# Altium schematic sheet [28] - PWR IN, MECH, DOC.SchDoc
size A2; DocumentNumber: 28; SheetNumber: 28; SheetTotal: 31
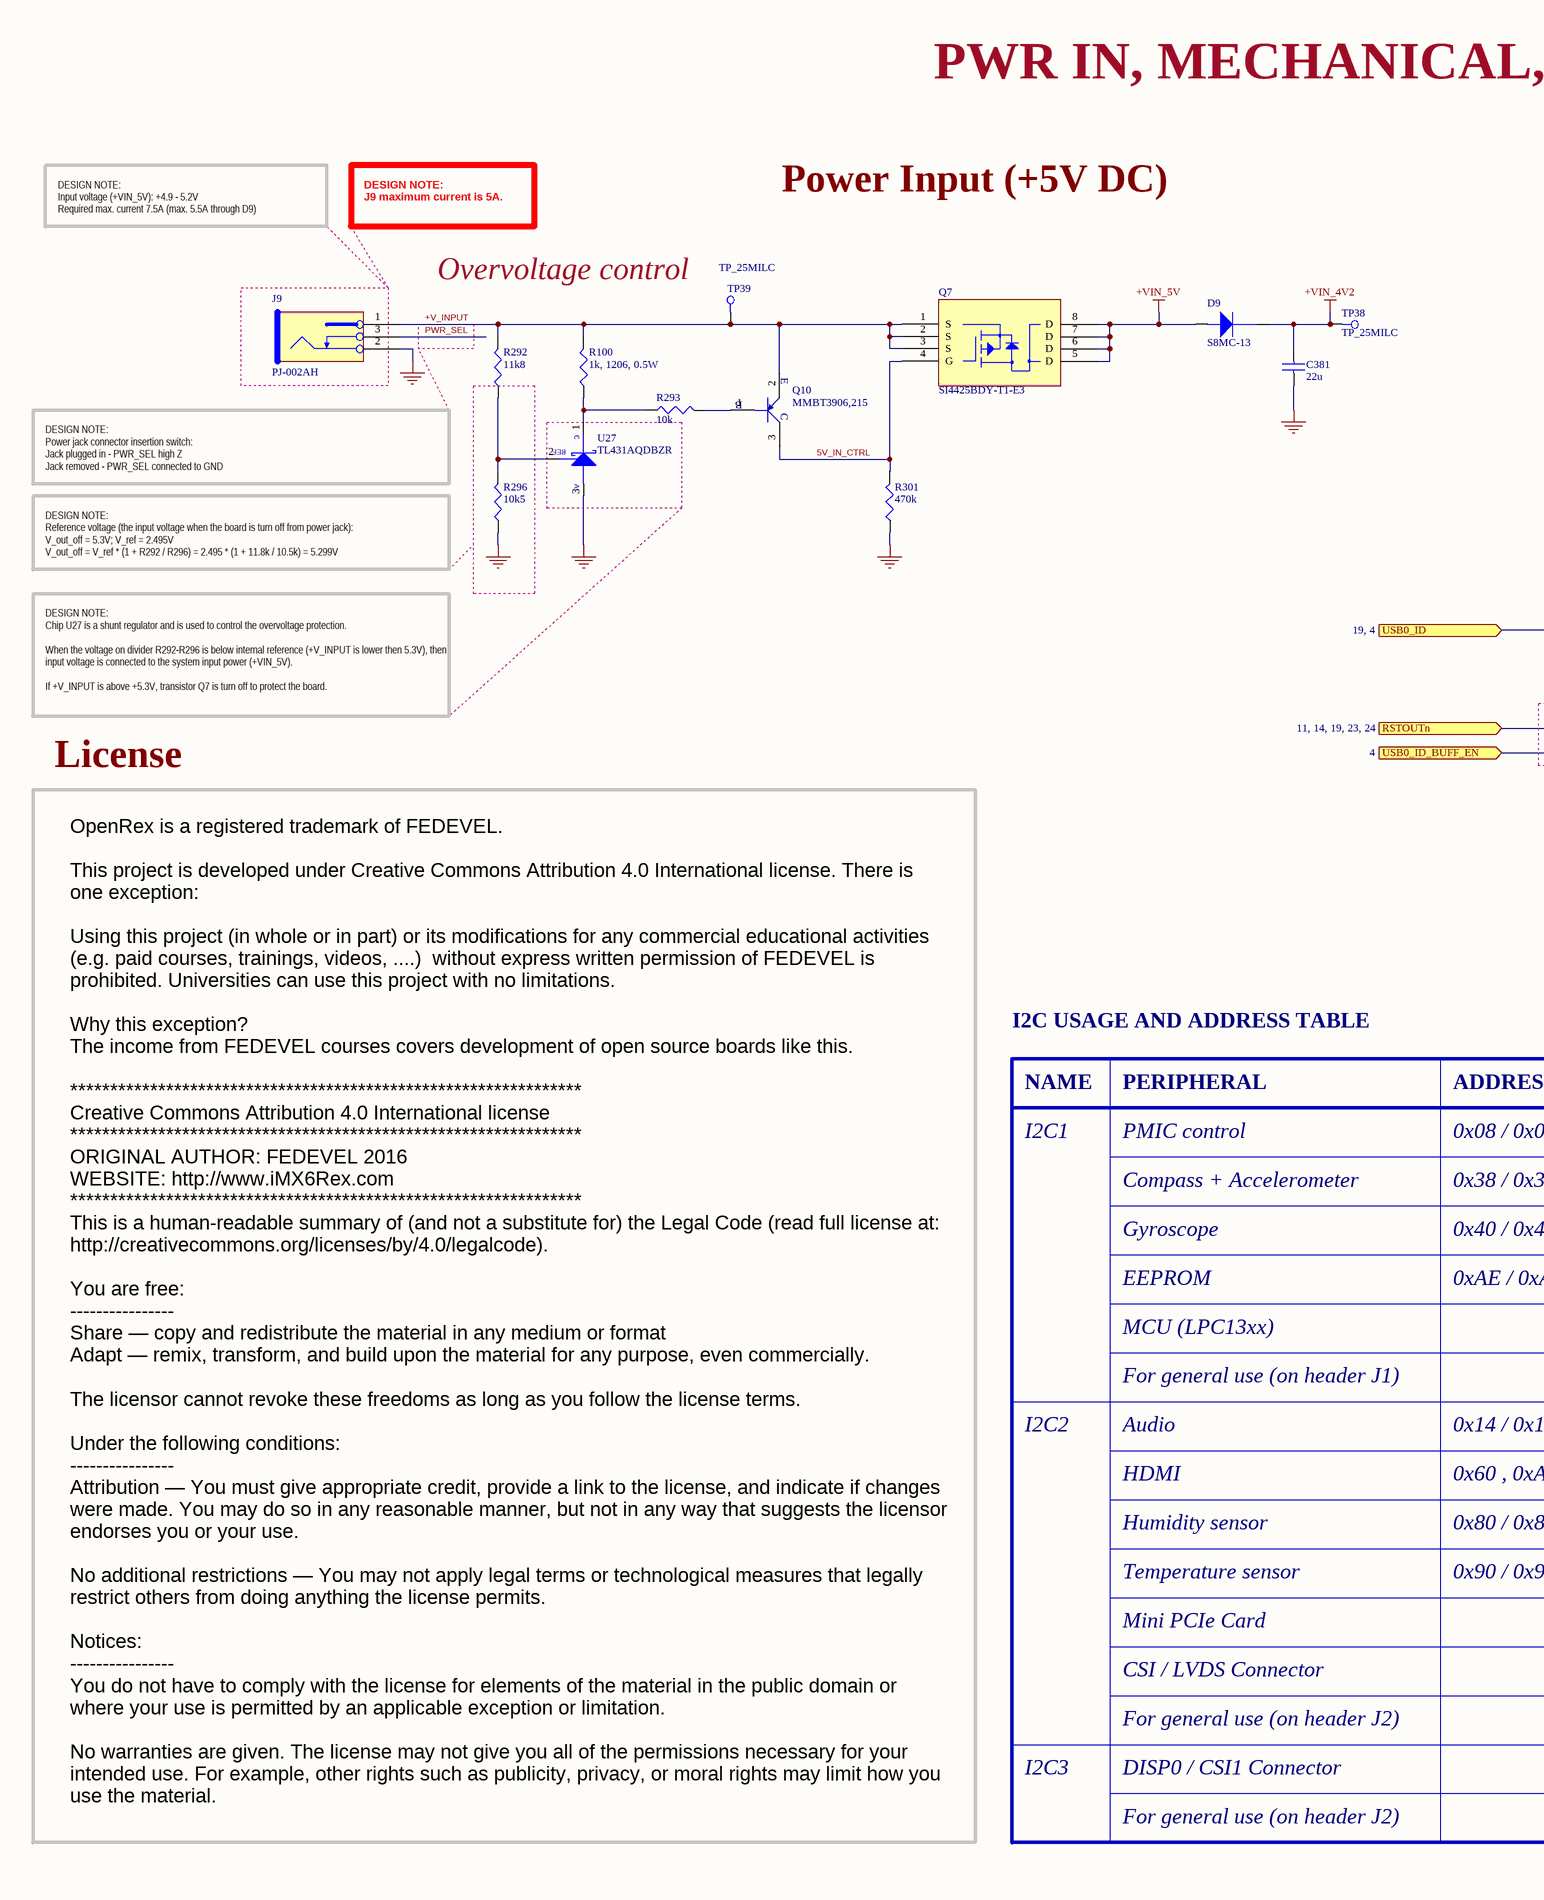
[diagram p0: [28] - PWR IN, MECH, DOC.SchDoc, left]
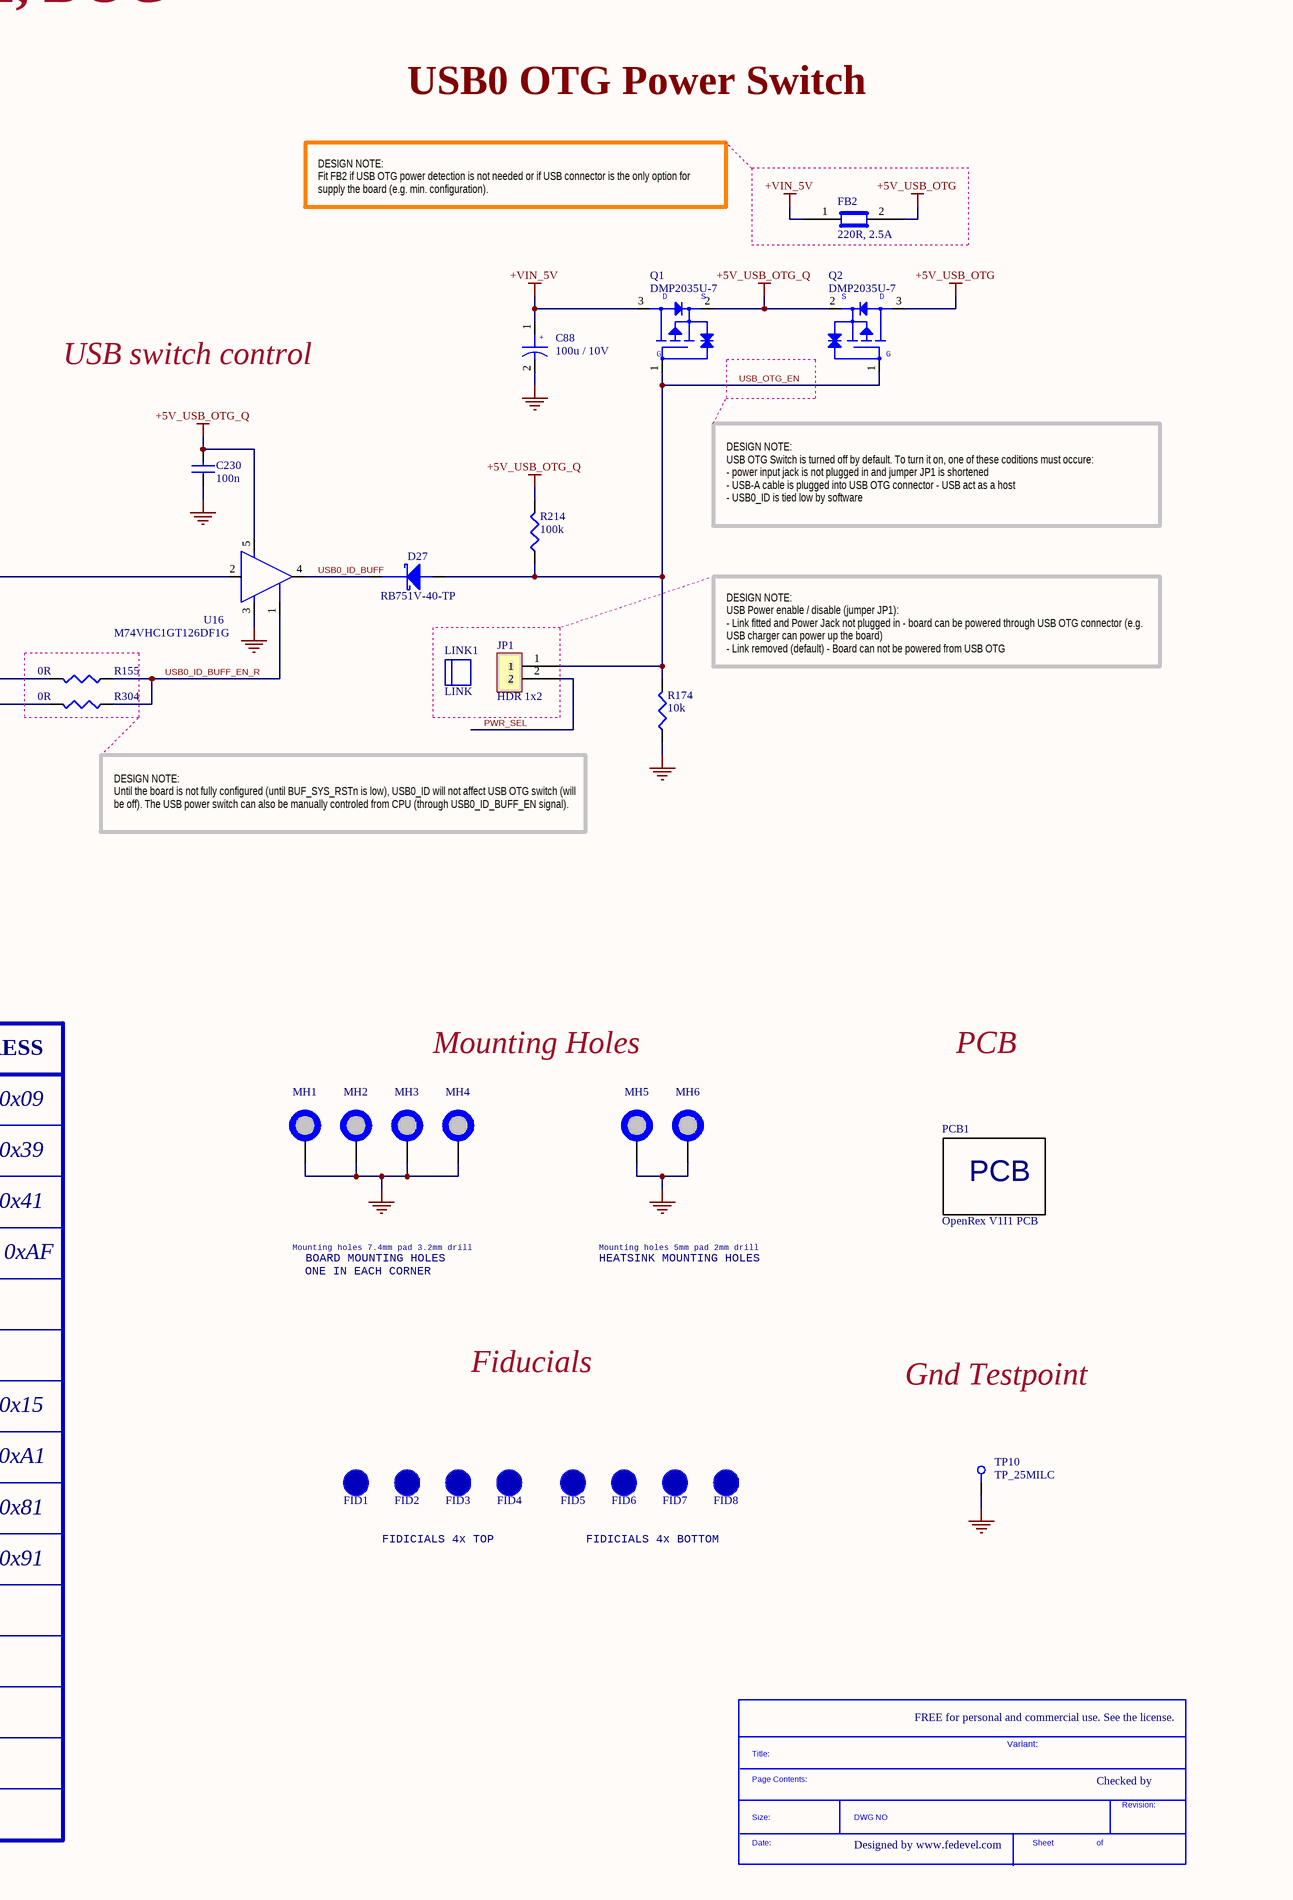
[diagram p1: [28] - PWR IN, MECH, DOC.SchDoc, right]

## Parts
*  SDTitleBlock  (value not drawn)  (graphical)
C88  100u / 10V  [C2312]
C230  100n  [C0402]
C381  22u  [C0603]
D9  S8MC-13  [SMC]
D27  RB751V-40-TP  [SOD323]
FB2  220R, 2.5A  [C0603]
FID1  FID_1MM_SMALL  [FID_40X52D]  (value not drawn)  (no BOM)
FID2  FID_1MM_SMALL  [FID_40X52D]  (value not drawn)  (no BOM)
FID3  FID_1MM_SMALL  [FID_40X52D]  (value not drawn)  (no BOM)
FID4  FID_1MM_SMALL  [FID_40X52D]  (value not drawn)  (no BOM)
FID5  FID_1MM_SMALL  [FID_40X52D]  (value not drawn)  (no BOM)
FID6  FID_1MM_SMALL  [FID_40X52D]  (value not drawn)  (no BOM)
FID7  FID_1MM_SMALL  [FID_40X52D]  (value not drawn)  (no BOM)
FID8  FID_1MM_SMALL  [FID_40X52D]  (value not drawn)  (no BOM)
J9  PJ-002AH  [POWER_JACK_5.5_2.1MM_NS_v1.1]
JP1  HDR 1x2  [HDR_1x2_2.54MM]
LINK1  LINK  (mechanical)
MH1  MH_7.4MMC_3.2MMD  [MH_7.4MMD_3.2MMD]  (value not drawn)  (no BOM)
MH2  MH_7.4MMC_3.2MMD  [MH_7.4MMD_3.2MMD]  (value not drawn)  (no BOM)
MH3  MH_7.4MMC_3.2MMD  [MH_7.4MMD_3.2MMD]  (value not drawn)  (no BOM)
MH4  MH_7.4MMC_3.2MMD  [MH_7.4MMD_3.2MMD]  (value not drawn)  (no BOM)
MH5  MH_5MMC_2MMD  [MH_5MMD_2MMD]  (value not drawn)  (no BOM)
MH6  MH_5MMC_2MMD  [MH_5MMD_2MMD]  (value not drawn)  (no BOM)
PCB1  OpenRex V1I1 PCB  (mechanical)
Q1  DMP2035U-7  [SOT-23-3-123]
Q2  DMP2035U-7  [SOT-23-3-123]
Q7  SI4425BDY-T1-E3  [8_SOIC_3.9MM]
Q10  MMBT3906,215  [SOT-23-3-123]
R100  1k, 1206, 0.5W  [R1206]
R155  0R  [R0402]
R174  10k  [R0402]
R214  100k  [R0402]
R292  11k8  [R0402]
R293  10k  [R0402]
R296  10k5  [R0402]
R301  470k  [R0402]
R304  0R  [R0402]
TP10  TP_25MILC  [TP_25C]  (no BOM)
TP38  TP_25MILC  [TP_25C]  (no BOM)
TP39  TP_25MILC  [TP_25C]  (no BOM)
U16  M74VHC1GT126DF1G  [SC70_5]
U27  TL431AQDBZR  [SOT-23-3-123]

## Ports
RSTOUTn (see 11, 14, 19, 23, 24), USB0_ID (see 19, 4), USB0_ID_BUFF_EN (in, see 4)

## Nets
+5V_USB_OTG: FB2.2 Q2.3
+5V_USB_OTG_Q: C230.2 Q1.2 Q2.2 R214.2 U16.5(VCC)
+VIN_4V2: C381.1 D9.1(Cathode) TP38.1
+VIN_5V: C88.1 D9.2(Anode) FB2.1 Q1.3 Q7.5(D) Q7.6(D) Q7.7(D) Q7.8(D)
GND: C88.2 C230.1 C381.2 J9.2 MH1.1 MH2.1 MH3.1 MH4.1 MH5.1 MH6.1 R174.1 R296.1 R301.1 TP10.1 U16.3(GND) U27.3(ANODE)
5V_IN_CTRL: Q7.4(G) Q10.3(C) R301.2
+V_INPUT: J9.1 Q7.1(S) Q7.2(S) Q7.3(S) Q10.2(E) R100.2 R292.2 TP39.1
PWR_SEL: J9.3 JP1.2
RSTOUTn: R155.2 ; port RSTOUTn
USB0_ID: U16.2(I) ; port USB0_ID
USB0_ID_BUFF: D27.1(cathode) U16.4(O)
USB0_ID_BUFF_EN: R304.2 ; port USB0_ID_BUFF_EN
USB0_ID_BUFF_EN_R: R155.1 R304.1 U16.1(OE#)
USB_OTG_EN: D27.2(ANODE) JP1.1 Q1.1 Q2.1 R174.2 R214.1
NetQ10_1: Q10.1(B) R293.2
NetR100_1: R100.1 R293.1 U27.1(cathode)
NetR292_1: R292.1 R296.2 U27.2(REF)

## Notes on the sheet
- PWR IN, MECHANICAL, DOC
- Power Input (+5V DC)
- USB0 OTG Power Switch
- DESIGN NOTE:
  Input voltage (+VIN_5V): +4.9 - 5.2V
  Required max. current 7.5A (max. 5.5A through D9)
- DESIGN NOTE:
  J9 maximum current is 5A.
- DESIGN NOTE:
  Fit FB2 if USB OTG power detection is not needed or if USB connector is the only option for supply the board (e.g. min. configuration).
- (near TP39) Overvoltage control
- USB switch control
- DESIGN NOTE:
  Power jack connector insertion switch:
  Jack plugged in - PWR_SEL high Z
  Jack removed - PWR_SEL connected to GND
- DESIGN NOTE:
  Reference voltage (the input voltage when the board is turn off from power jack):
  V_out_off = 5.3V; V_ref = 2.495V
  V_out_off = V_ref * (1 + R292 / R296) = 2.495 * (1 + 11.8k / 10.5k) = 5.299V
- DESIGN NOTE:
  USB OTG Switch is turned off by default. To turn it on, one of these coditions must occure:
  - power input jack is not plugged in and jumper JP1 is shortened
  - USB-A cable is plugged into USB OTG connector - USB act as a host
  - USB0_ID is tied low by software
- DESIGN NOTE:
  Chip U27 is a shunt regulator and is used to control the overvoltage protection.
  When the voltage on divider R292-R296 is below internal reference (+V_INPUT is lower then 5.3V), then input voltage is connected to the system input power (+VIN_5V).
  If +V_INPUT is above +5.3V, transistor Q7 is turn off to protect the board.
- DESIGN NOTE:
  USB Power enable / disable (jumper JP1):
  - Link fitted and Power Jack not plugged in - board can be powered through USB OTG connector (e.g. USB charger can power up the board)
  - Link removed (default) - Board can not be powered from USB OTG
- License
- DESIGN NOTE:
  Until the board is not fully configured (until BUF_SYS_RSTn is low), USB0_ID will not affect USB OTG switch (will be off). The USB power switch can also be manually controled from CPU (through USB0_ID_BUFF_EN signal).
- I2C USAGE AND ADDRESS TABLE
- NAME
- PERIPHERAL
- ADDRESS
- Mounting Holes
- PCB
- I2C1
- Compass + Accelerometer
- PMIC control
- 0x38 / 0x39
- 0x08 / 0x09
- Gyroscope
- 0x40 / 0x41
- EEPROM
- 0xAE / 0xAF
- Mounting holes 7.4mm pad 3.2mm drill
- BOARD MOUNTING HOLES
- ONE IN EACH CORNER
- HEATSINK MOUNTING HOLES
- Mounting holes 5mm pad 2mm drill
- MCU (LPC13xx)
- I2C2
- For general use (on header J1)
- Audio
- 0x14 / 0x15
- Fiducials
- Gnd Testpoint
- HDMI
- 0x60 , 0xA1
- Humidity sensor
- 0x80 / 0x81
- FIDICIALS 4x TOP
- FIDICIALS 4x BOTTOM
- Temperature sensor
- 0x90 / 0x91
- Mini PCIe Card
- CSI / LVDS Connector
- For general use (on header J2)
- FREE for personal and commercial use. See the license.
- I2C3
- DISP0 / CSI1 Connector
- Variant:
- Checked by
- OpenRex is a registered trademark of FEDEVEL.
  This project is developed under Creative Commons Attribution 4.0 International license. There is one exception:
  Using this project (in whole or in part) or its modifications for any commercial educational activities (e.g. paid courses, trainings, videos, ....)  without express written permission of FEDEVEL is prohibited. Universities can use this project with no limitations.
  Why this exception?
  The income from FEDEVEL courses covers development of open source boards like this.
  ****************************************************************
  Creative Commons Attribution 4.0 International license
  ****************************************************************
  ORIGINAL AUTHOR: FEDEVEL 2016
  WEBSITE: http://www.iMX6Rex.com
  ****************************************************************
  This is a human-readable summary of (and not a substitute for) the Legal Code (read full license at:
  http://creativecommons.org/licenses/by/4.0/legalcode).
  You are free:
  ----------------
  Share — copy and redistribute the material in any medium or format
  Adapt — remix, transform, and build upon the material for any purpose, even commercially.
  The licensor cannot revoke these freedoms as long as you follow the license terms.
  Under the following conditions:
  ----------------
  Attribution — You must give appropriate credit, provide a link to the license, and indicate if changes were made. You may do so in any reasonable manner, but not in any way that suggests the licensor endorses you or your use.
  No additional restrictions — You may not apply legal terms or technological measures that legally restrict others from doing anything the license permits.
  Notices:
  ----------------
  You do not have to comply with the license for elements of the material in the public domain or where your use is permitted by an applicable exception or limitation.
  No warranties are given. The license may not give you all of the permissions necessary for your intended use. For example, other rights such as publicity, privacy, or moral rights may limit how you use the material.
- Designed by www.fedevel.com
- (in symbol DMP2035U-7) D; S; G
- (in symbol PCB_OpenRex_V1I1) PCB
- (in symbol SDTitleBlock) Title:; Page Contents:; Revision:; Size:; DWG NO; Date:; Sheet; of
- (in symbol TL431AQDBZR) C; A
- (in symbol TPSC107K010R0150) +

## Library data of the parts
C88 = TPSC107K010R0150: CAP TANT 100UF 10V 10% 2312; Manufacturer: AVX Corporation; Manufacturer Size Code: C; Capacitance: 100µF; ESR (Equivalent Series Resistance): 150 mOhm; Type: Molded; .Creator: MM; Supplier 1: Digi-Key; Manufacturer Part Number: TPSC107K010R0150; RoHS: RoHS Compliant; Category: Capacitors; Stock 1: 3211; Pricing 1: 1=1, 10=0.85, 100=0.4969, 250=0.4168 (USD); Packaging: Cut Tape (CT); Tolerance: ±10%; Voltage - Rated: 10V; Operating Temperature: -55°C ~ 125°C; Mounting Type: Surface Mount; Package / Case: 2312 (6032 Metric); Size / Dimension: 0.236" L x 0.126" W (6.00mm x 3.20mm); Height - Seated (Max): 0.110" (2.80mm); Lead Spacing: -; Features: General Purpose; Lifetime @ Temp.: -; ComponentLink1URL: http://www.avx.com/docs/Catalogs/tps.pdf; ComponentLink1Description: http://www.avx.com/docs/Catalogs/tps.pdf; Supplier Part Number 1: 478-7995-1-ND; .Checked PCB: MM; .Checked SCH: MM
C230 = C1005X5R1H104K: CAP CER .10UF 50V X5R 10% 0402; Manufacturer: TDK Corporation; Capacitance: 0.1µF; Value: 100nF; .Checked PCB: used; Category: Capacitors; Supplier Part Number: 445-5942-1-ND; Manufacturer Part Number: C1005X5R1H104K; Operating Temperature: -55°C ~ 85°C; Package / Case: 0402 (1005 Metric); Price 1k [$]: 0.02340; .Checked SCH: used; Voltage - Rated: 50V; Supplier: Digikey; Supplier 1: Digi-Key; Supplier Part Number 1: 445-5942-1-ND; RoHS: RoHS Compliant; Stock 1: 106926; Pricing 1: 1=0.27, 10=0.18, 100=0.072, 250=0.05176, 500=0.0369, 1000=0.027 (USD); Tolerance: ±10%; Temperature Coefficient: X5R; Mounting Type: Surface Mount, MLCC; Applications: General Purpose; Ratings: -; Size / Dimension: 0.039" L x 0.020" W (1.00mm x 0.50mm); Height - Seated (Max): -; Thickness (Max): 0.022" (0.55mm); Lead Spacing: -; Features: -; Packaging: Cut Tape (CT); Lead Style: -; ComponentLink1URL: http://www.tdk.co.jp/tefe02/e412_c.pdf; ComponentLink1Description: http://www.tdk.co.jp/tefe02/e412_c.pdf
C381 = C1608X5R0J226M080AC: CAP CER 22UF 6.3V 20% X5R 0603; Manufacturer: TDK Corporation; Capacitance: 22µF; .Creator: MM; Supplier 1: Digi-Key; Manufacturer Part Number: C1608X5R0J226M080AC; RoHS: RoHS Compliant; Category: Capacitors; Stock 1: 593047; Pricing 1: 1=0.39, 10=0.343, 100=0.1714, 250=0.13708, 500=0.12484, 1000=0.1104 (USD); Packaging: Cut Tape (CT); Tolerance: ±20%; Voltage - Rated: 6.3V; Temperature Coefficient: X5R; Mounting Type: Surface Mount, MLCC; Operating Temperature: -55°C ~ 85°C; Applications: General Purpose; Ratings: -; Package / Case: 0603 (1608 Metric); Size / Dimension: 0.063" L x 0.031" W (1.60mm x 0.80mm); Height - Seated (Max): -; Thickness (Max): 0.039" (1.00mm); Lead Spacing: -; Features: -; Lead Style: -; ComponentLink1URL: http://product.tdk.com/en/catalog/datasheets/mlcc_commercial_general_en.pdf; ComponentLink1Description: http://product.tdk.com/en/catalog/datasheets/mlcc_commercial_general_en.pdf; Supplier Part Number 1: 445-8028-1-ND; .Checked PCB: MM; .Checked SCH: MM
D9 = S8MC-13: DIODE GEN PURP 1KV 8A SMC; Manufacturer: Diodes Incorporated; Diode Type: Standard; Voltage - DC Reverse (Vr) (Max): 1000V (1kV); Voltage - Forward (Vf) (Max) @ If: 985mV @ 8A; Speed: Standard Recovery >500ns, > 200mA (Io); Current - Reverse Leakage @ Vr: 10µA @ 1000V; Capacitance @ Vr, F: 40pF @ 4V, 1MHz; .Checked PCB: MM; Supplier 1: Digi-Key; Manufacturer Part Number: S8MC-13; RoHS: RoHS Compliant; Category: Discrete Semiconductor Products; Stock 1: 79939; Pricing 1: 1=0.66, 10=0.578, 25=0.5104, 100=0.4448, 250=0.3872, 500=0.3296, 1000=0.264 (USD); Packaging: Cut Tape (CT); Current - Average Rectified (Io): 8A; Reverse Recovery Time (trr): -; Mounting Type: Surface Mount; Package / Case: DO-214AB, SMC; Supplier Device Package: SMC; Operating Temperature - Junction: -65°C ~ 150°C; ComponentLink1URL: http://www.diodes.com/datasheets/ds31117.pdf; ComponentLink1Description: http://www.diodes.com/datasheets/ds31117.pdf; Supplier Part Number 1: S8MCDICT-ND; .Checked SCH: MM; .Creator: MM
D27 = RB751V-40-TP: DIODE SCHTKY 30MA 30V SOD-323; Manufacturer: Micro Commercial Co; Diode Type: Schottky; Voltage - Forward (Vf) (Max) @ If: 370mV @ 1mA; Speed: Small Signal =< 200mA (Io), Any Speed; Current - Reverse Leakage @ Vr: 500nA @ 30V; Capacitance @ Vr, F: 2pF @ 1V, 1MHz; .Checked PCB: used; Supplier 1: Digi-Key; Supplier Part Number 1: RB751V-40-TPMSCT-ND; Manufacturer Part Number: RB751V-40-TP; RoHS: RoHS Compliant; Category: Discrete Semiconductor Products; Stock 1: 18964; Pricing 1: 1=0.48, 10=0.342, 100=0.2014, 250=0.14252, 500=0.1216, 1000=0.095 (USD); Voltage - DC Reverse (Vr) (Max): 30V; Current - Average Rectified (Io): 30mA; Reverse Recovery Time (trr): -; Mounting Type: Surface Mount; Package / Case: SC-76, SOD-323; Supplier Device Package: SOD-323; Packaging: Cut Tape (CT); ComponentLink1URL: http://61.222.192.61/mccsemi/up_pdf/RB751V-40(SOD-323).PDF; ComponentLink1Description: http://61.222.192.61/mccsemi/up_pdf/RB751V-40(SOD-323).PDF; .Checked SCH: used
FB2 = BLM18SG221TN1D: FERRITE CHIP 220 OHM 2500MA 0603; Manufacturer: Murata Electronics North America; Impedance @ Frequency: 220 Ohm @ 100MHz; DC Resistance (DCR): 40 mOhm Max; Filter Type: Differential Mode - Single; Number of Lines: 1; .Checked PCB: used; Supplier 1: Digi-Key; Supplier Part Number 1: 490-5225-1-ND; Manufacturer Part Number: BLM18SG221TN1D; RoHS: RoHS Compliant; Category: Filters; Stock 1: 54640; Pricing 1: 1=0.38, 10=0.282, 50=0.1646, 100=0.1316, 250=0.094, 500=0.06392, 1000=0.0517, 5000=0.04042 (USD); Current Rating: 2.5A; Package / Case: 0603 (1608 Metric); Mounting Type: Surface Mount; Packaging: Cut Tape (CT); Height (Max): 0.037" (0.95mm); Size / Dimension: 0.063" L x 0.031" W (1.60mm x 0.80mm); ComponentLink1URL: http://search.murata.co.jp/Ceramy/image/img/PDF/ENG/L0110S0100BLM18S.pdf; ComponentLink1Description: http://search.murata.co.jp/Ceramy/image/img/PDF/ENG/L0110S0100BLM18S.pdf; .Checked SCH: used
FID1-FID8 = FID_1MM_SMALL: Fiducial 40mil Diameter, 52mil Mask; Supplier: Digikey
J9 = PJ-002AH_v1.1: CONN PWR JACK 2.1X5.5MM HIGH CUR; Manufacturer: CUI Inc; .Checked PCB: MM; Mating connector: 2.1mm ID, 5.5mm OD; Gender: Male; Number of Positions/Contacts: 2 Conductors, 3 Contacts; Internal Switch(s): Single Switch, Normally Closed; Shielding: Unshielded; Voltage - Rated: 24VDC; Current Rating: 5A; .Checked SCH: MM; Category: Connectors, Interconnects; Family: Barrel - Power; Manufacturer Part Number: PJ-002AH; Operating Temperature: -25°C ~ 85°C; Price 1k [$]: 0.23625; Supplier: Digikey; Supplier Part Number: CP-002AH-ND; Value: PJ-002AH; Supplier 1: Digi-Key; Supplier Part Number 1: CP-002AH-ND; RoHS: RoHS Compliant; Stock 1: 138933; Pricing 1: 1=1.01, 10=0.704, 100=0.4724, 500=0.3819, 1000=0.3417, 2500=0.27135 (USD); Connector Type: Jack; Plug/Mating Plug Diameter: 2.1mm ID, 5.5mm OD; Mounting Type: Through Hole, Right Angle; Termination: Solder Eyelet(s); Features: -; Color: Black; Contact Material: Copper Alloy; Contact Material - Plating: Nickel; Housing Color: Black; Housing Material: Thermoplastic; ComponentLink1URL: http://products.cui.com/GetSpecForDigiKey.aspx?MFGNum=PJ-002AH; ComponentLink1Description: http://products.cui.com/GetSpecForDigiKey.aspx?MFGNum=PJ-002AH; .Creator: MM
JP1 = 68001-202HLF: BERGSTIK II .100" SR STRAIGHT; Manufacturer: FCI; Connector Type: Header, Unshrouded; Number of Positions: 2; Number of Positions Loaded: All; Pitch: 0.100" (2.54mm); .Checked PCB: used; Supplier 1: Digi-Key; Supplier Part Number 1: 609-3469-ND; Manufacturer Part Number: 68001-202HLF; RoHS: RoHS Compliant; Category: Connectors, Interconnects; Stock 1: 13680; Pricing 1: 1=0.45, 10=0.265, 100=0.1172, 250=0.09828, 500=0.09072, 1000=0.07938, 5000=0.05065 (USD); Contact Type: Male Pin; Number of Rows: 1; Row Spacing: -; Contact Mating Length: 0.230" (5.84mm); Mounting Type: Through Hole; Termination: Solder; Fastening Type: -; Features: -; Contact Finish: Gold; Contact Finish Thickness: 15µin (0.38µm); Color: Black; Packaging: Bulk; ComponentLink1URL: http://portal.fciconnect.com/res/en/pdffiles/doc_search/68000.pdf; ComponentLink1Description: http://portal.fciconnect.com/res/en/pdffiles/doc_search/68000.pdf; .Checked SCH: used
LINK1 = QPC02SXGN-RC: CONN JUMPER SHORTING .100" GOLD; Manufacturer: Sullins Connector Solutions; Gender: Female Sockets; Number of Positions or Pins (Grid): 2 (1 x 2); Pitch: 0.100" (2.54mm); .Checked SCH: used; Supplier 1: Digi-Key; Supplier Part Number 1: S9337-ND; Manufacturer Part Number: QPC02SXGN-RC; RoHS: RoHS Compliant; Category: Connectors, Interconnects; Stock 1: 23274; Pricing 1: 1=0.11, 10=0.066, 25=0.0468, 50=0.0384, 100=0.033, 250=0.02792, 500=0.0258, 1000=0.0228, 2500=0.018 (USD); Type: Open Top; Height: 0.235" (5.97mm); Contact Finish: Gold; Contact Finish Thickness: Flash; Color: -; Packaging: Bulk; ComponentLink1URL: http://www.sullinscorp.com/drawings/284_SXGN_11510.pdf; ComponentLink1Description: http://www.sullinscorp.com/drawings/284_SXGN_11510.pdf
MH1-MH4 = MH_7.4MMC_3.2MMD: Mounting Hole 7.4mm Diameter, 3.2mm Drill; .Creator: MM
MH5 MH6 = MH_5MMC_2MMD: Mounting Hole 5mm Diameter, 2mm Drill; .Creator: MM
PCB1 = PCB_OpenRex_V1I1: .Creator: MM; Category: Printed circuits board; .Checked SCH: MM
Q1 Q2 = DMP2035U-7: MOSFET P-CH 20V 3.6A SOT-23; Manufacturer: Diodes Incorporated; FET Type: MOSFET P-Channel, Metal Oxide; FET Feature: Logic Level Gate; Current - Continuous Drain (Id) @ 25°C: 3.6A (Ta); Rds On (Max) @ Id, Vgs: 35 mOhm @ 4A, 4.5V; Vgs(th) (Max) @ Id: 1V @ 250µA; Gate Charge (Qg) @ Vgs: 15.4nC @ 4.5V; Input Capacitance (Ciss) @ Vds: 1610pF @ 10V; Power - Max: 810mW; .Checked PCB: MM; Supplier 1: Digi-Key; Manufacturer Part Number: DMP2035U-7; RoHS: RoHS Compliant; Category: Discrete Semiconductor Products; Stock 1: 71721; Pricing 1: 1=0.49, 10=0.345, 25=0.2836, 100=0.2265, 250=0.165, 500=0.134, 1000=0.103 (USD); Packaging: Cut Tape (CT); Drain to Source Voltage (Vdss): 20V; Mounting Type: Surface Mount; Package / Case: TO-236-3, SC-59, SOT-23-3; Supplier Device Package: SOT-23-3; ComponentLink1URL: http://www.diodes.com/datasheets/ds31830.pdf; ComponentLink1Description: http://www.diodes.com/datasheets/ds31830.pdf; Supplier Part Number 1: DMP2035U-7DICT-ND; .Checked SCH: MM; .Creator: MM
Q7 = SI4425BDY-T1-E3: MOSFET P-CH 30V 8.8A 8-SOIC; Manufacturer: Vishay Siliconix; FET Type: MOSFET P-Channel, Metal Oxide; FET Feature: Logic Level Gate; Current - Continuous Drain (Id) @ 25°C: 8.8A (Ta); Rds On (Max) @ Id, Vgs: 12 mOhm @ 11.4A, 10V; Vgs(th) (Max) @ Id: 3V @ 250µA; Gate Charge (Qg) @ Vgs: 100nC @ 10V; Power - Max: 1.5W; .Checked PCB: MM; Supplier 1: Digi-Key; Manufacturer Part Number: SI4425BDY-T1-E3; RoHS: RoHS Compliant; Category: Discrete Semiconductor Products; Stock 1: 26582; Pricing 1: 1=1, 10=0.88, 25=0.7948, 100=0.6955, 250=0.60996, 500=0.54096, 1000=0.4278 (USD); Packaging: Cut Tape (CT); Drain to Source Voltage (Vdss): 30V; Input Capacitance (Ciss) @ Vds: -; Mounting Type: Surface Mount; Package / Case: 8-SOIC (0.154", 3.90mm Width); Supplier Device Package: 8-SO; ComponentLink1URL: http://www.vishay.com/docs/72000/72000.pdf; ComponentLink1Description: http://www.vishay.com/docs/72000/72000.pdf; Supplier Part Number 1: SI4425BDY-T1-E3CT-ND; .Checked SCH: MM; .Creator: MM
Q10 = MMBT3906,215: TRANS PNP 40V 0.2A SOT23; Manufacturer: NXP Semiconductors; Current - Collector (Ic) (Max): 200mA; Vce Saturation (Max) @ Ib, Ic: 400mV @ 5mA, 50mA; DC Current Gain (hFE) (Min) @ Ic, Vce: 100 @ 10mA, 1V; Power - Max: 250mW; Frequency - Transition: 250MHz; .Checked PCB: MM; Supplier 1: Digi-Key; Manufacturer Part Number: MMBT3906,215; RoHS: RoHS Compliant; Category: Discrete Semiconductor Products; Stock 1: 39823; Pricing 1: 1=0.14, 10=0.125, 25=0.1132, 100=0.0816, 250=0.04804, 500=0.03986, 1000=0.02719 (USD); Packaging: Cut Tape (CT); Transistor Type: PNP; Voltage - Collector Emitter Breakdown (Max): 40V; Current - Collector Cutoff (Max): -; Mounting Type: Surface Mount; Package / Case: TO-236-3, SC-59, SOT-23-3; Supplier Device Package: SOT-23 (TO-236AB); ComponentLink1URL: http://www.nxp.com/documents/data_sheet/MMBT3906.pdf; ComponentLink1Description: http://www.nxp.com/documents/data_sheet/MMBT3906.pdf; Supplier Part Number 1: 568-4511-1-ND; .Checked SCH: MM; .Creator: MM
R100 = RNCP1206FTD1K00: RES SMD 1K OHM 1% 1/2W 1206; Manufacturer: Stackpole Electronics Inc; Power (Watts): 0.5W, 1/2W; Temperature Coefficient: ±100ppm/°C; .Checked PCB: MM; Supplier 1: Digi-Key; Manufacturer Part Number: RNCP1206FTD1K00; RoHS: RoHS Compliant; Category: Resistors; Stock 1: 120283; Pricing 1: 1=0.1, 10=0.065, 50=0.0356, 100=0.0271, 250=0.02016, 500=0.01488, 1000=0.00992, 2500=0.00837 (USD); Packaging: Cut Tape (CT); Resistance (Ohms): 1k; Tolerance: ±1%; Composition: Thin Film; Features: Anti-Sulfur; Operating Temperature: -55°C ~ 155°C; Package / Case: 1206 (3216 Metric); Supplier Device Package: 1206; Size / Dimension: 0.122" L x 0.059" W (3.10mm x 1.50mm); Height: 0.024" (0.60mm); Number of Terminations: 2; ComponentLink1URL: http://www.seielect.com/catalog/SEI-RNCP.pdf; ComponentLink1Description: http://www.seielect.com/catalog/SEI-RNCP.pdf; Supplier Part Number 1: RNCP1206FTD1K00CT-ND; .Checked SCH: MM; .Creator: MM
R155 R304 = RC0402JR-070RL: RES 0.0 OHM 1/16W 0402 SMD; Manufacturer: Yageo; Resistance (Ohms): 0.0; Power (Watts): 0.063W, 1/16W; Tolerance: Jumper; .Checked PCB: used; Category: Resistors; Supplier Part Number: 311-0.0JRCT-ND; Manufacturer Part Number: RC0402JR-070RL; Package / Case: 0402 (1005 Metric); Price 1k [$]: 0.01389; Value: 0R; .Checked SCH: used; Supplier: Digikey; Supplier 1: Digi-Key; Supplier Part Number 1: 311-0.0JRCT-ND; RoHS: RoHS Compliant; Stock 1: 1106330; Pricing 1: 10=0.012, 50=0.009, 100=0.0069, 250=0.00512, 500=0.0038, 1000=0.00253 (USD); Composition: Thick Film; Features: -; Temperature Coefficient: -; Size / Dimension: 0.039" L x 0.020" W (1.00mm x 0.50mm); Height: 0.016" (0.40mm); Number of Terminations: 2; Packaging: Cut Tape (CT); ComponentLink1URL: http://www.yageo.com/documents/recent/PYu-RC0402_51_RoHS_L_6.pdf; ComponentLink1Description: http://www.yageo.com/documents/recent/PYu-RC0402_51_RoHS_L_6.pdf
R174 R293 = RC0402FR-0710KL: RES 10.0K OHM 1/16W 1% 0402 SMD; Manufacturer: Yageo; Power (Watts): 0.063W, 1/16W; .Checked PCB: used; Temperature Coefficient: ±100ppm/°C; Category: Resistors; Supplier Part Number: 311-10.0KLRCT-ND; Manufacturer Part Number: RC0402FR-0710KL; Package / Case: 0402 (1005 Metric); Price 1k [$]: 0.01421; Resistance (Ohms): 10K; Tolerance: ±1%; Value: 10k; .Checked SCH: used; Supplier: Digikey; Supplier 1: Digi-Key; Supplier Part Number 1: 311-10.0KLRCT-ND; RoHS: RoHS Compliant; Stock 1: 2916495; Pricing 1: 10=0.014, 50=0.0104, 100=0.0079, 250=0.00584, 500=0.00432, 1000=0.00288 (USD); Composition: Thick Film; Features: -; Size / Dimension: 0.039" L x 0.020" W (1.00mm x 0.50mm); Height: 0.016" (0.40mm); Number of Terminations: 2; Packaging: Cut Tape (CT); ComponentLink1URL: http://www.yageo.com/documents/recent/PYu-RC0402_51_RoHS_L_6.pdf; ComponentLink1Description: http://www.yageo.com/documents/recent/PYu-RC0402_51_RoHS_L_6.pdf
R214 = RMCF0402FT100K: RES 100K OHM 1/16W 1% 0402 SMD; Manufacturer: Stackpole Electronics Inc; Power (Watts): 0.063W, 1/16W; .Checked PCB: used; Temperature Coefficient: ±100ppm/°C; Category: Resistors; Supplier Part Number: RMCF0402FT100KCT-ND; Manufacturer Part Number: RMCF0402FT100K; Package / Case: 0402 (1005 Metric); Price 1k [$]: 0.00384; Resistance (Ohms): 100K; Tolerance: ±1%; Value: 100k; .Checked SCH: used; Supplier: Digikey; Supplier 1: Digi-Key; Supplier Part Number 1: RMCF0402FT100KCT-ND; RoHS: RoHS Compliant; Stock 1: 95; Pricing 1: 1=0.04, 10=0.025, 50=0.0138, 100=0.0105, 250=0.0078, 500=0.00576, 1000=0.00384 (USD); Composition: Thick Film; Features: -; Size / Dimension: 0.039" L x 0.020" W (1.00mm x 0.50mm); Height: 0.016" (0.40mm); Number of Terminations: 2; Packaging: Cut Tape (CT); ComponentLink1URL: http://www.seielect.com/Catalog/SEI-RMCF.pdf; ComponentLink1Description: http://www.seielect.com/Catalog/SEI-RMCF.pdf
R292 = CRCW040211K8FKED: RES 11.8K OHM 1/16W 1% 0402 SMD; Manufacturer: Vishay Dale; Power (Watts): 0.063W, 1/16W; Temperature Coefficient: ±100ppm/°C; .Checked PCB: RF; Supplier 1: Digi-Key; Supplier Part Number 1: 541-11.8KLCT-ND; Manufacturer Part Number: CRCW040211K8FKED; RoHS: RoHS Compliant; Category: Resistors; Stock 1: 30358; Pricing 1: 10=0.083, 50=0.0444, 200=0.0255, 1000=0.0174 (USD); Resistance (Ohms): 11.8K; Composition: Thick Film; Features: -; Tolerance: ±1%; Package / Case: 0402 (1005 Metric); Size / Dimension: 0.039" L x 0.020" W (1.00mm x 0.50mm); Height: 0.016" (0.40mm); Number of Terminations: 2; Packaging: Cut Tape (CT); ComponentLink1URL: http://www.vishay.com/doc?20035; ComponentLink1Description: http://www.vishay.com/doc?20035; .Checked SCH: RF
R296 = CRCW040210K5FKED: RES 10.5K OHM 1/16W 1% 0402 SMD; Manufacturer: Vishay/Dale; Power (Watts): 0.063W, 1/16W; .Checked PCB: used; Temperature Coefficient: ±100ppm/°C; Category: Resistors; Supplier Part Number: 541-10.5KLCT-ND; Manufacturer Part Number: CRCW040210K5FKED; Package / Case: 0402 (1005 Metric); Price 1k [$]: 0.01740; Resistance (Ohms): 10.5K; Tolerance: ±1%; Value: 10k5; .Checked SCH: used; Supplier: Digikey; Supplier 1: Digi-Key; Supplier Part Number 1: 541-10.5KLCT-ND; RoHS: RoHS Compliant; Stock 1: 36157; Pricing 1: 10=0.083, 50=0.0444, 200=0.0255, 1000=0.0174 (USD); Composition: Thick Film; Features: -; Size / Dimension: 0.039" L x 0.020" W (1.00mm x 0.50mm); Height: 0.016" (0.40mm); Number of Terminations: 2; Packaging: Cut Tape (CT); ComponentLink1URL: http://www.vishay.com/doc?20035; ComponentLink1Description: http://www.vishay.com/doc?20035
R301 = CRCW0402470KFKED: RES 470K OHM 1/16W 1% 0402 SMD; Manufacturer: Vishay Dale; Power (Watts): 0.063W, 1/16W; Temperature Coefficient: ±100ppm/°C; .Checked PCB: MM; Supplier 1: Digi-Key; Supplier Part Number 1: 541-470KLCT-ND; Manufacturer Part Number: CRCW0402470KFKED; RoHS: RoHS Compliant; Category: Resistors; Stock 1: 9270; Pricing 1: 10=0.083, 50=0.0444, 200=0.0255, 1000=0.0174 (USD); Resistance (Ohms): 470K; Composition: Thick Film; Features: -; Tolerance: ±1%; Size / Dimension: 0.039" L x 0.020" W (1.00mm x 0.50mm); Height: 0.016" (0.40mm); Number of Terminations: 2; Packaging: Cut Tape (CT); Package / Case: 0402 (1005 Metric); ComponentLink1URL: http://www.vishay.com/doc?20035; ComponentLink1Description: http://www.vishay.com/doc?20035; .Checked SCH: MM
TP10 TP38 TP39 = TP_25MILC: Test Point 25mil
U16 = M74VHC1GT126DF1G: IC BUFF CMOS LVL/SFTR N-I SOT353; Manufacturer: ON Semiconductor; Logic Type: Buffer/Line Driver, Non-Inverting; Number of Elements: 1; Current - Output High, Low: 8mA, 8mA; Voltage - Supply: 3 V ~ 5.5 V; .Checked PCB: MM; Supplier 1: Digi-Key; Manufacturer Part Number: M74VHC1GT126DF1G; RoHS: RoHS Compliant; Category: Integrated Circuits (ICs); Stock 1: 6821; Pricing 1: 1=0.36, 10=0.326, 25=0.2344, 100=0.1824, 250=0.1146, 500=0.09766, 1000=0.06654 (USD); Packaging: Cut Tape (CT); Number of Bits per Element: 1; Operating Temperature: -55°C ~ 125°C; Mounting Type: Surface Mount; Package / Case: 5-TSSOP, SC-70-5, SOT-353; Supplier Device Package: SC-70; ComponentLink1URL: http://www.onsemi.com/pub_link/Collateral/MC74VHC1GT126-D.PDF; ComponentLink1Description: http://www.onsemi.com/pub_link/Collateral/MC74VHC1GT126-D.PDF; Supplier Part Number 1: M74VHC1GT126DF1GOSCT-ND; .Checked SCH: MM; .Creator: MM
U27 = TL431AQDBZR: IC VREF SHUNT ADJ SOT23-3; Manufacturer: Texas Instruments; Output Type: Adjustable; Voltage - Output (Min/Fixed): 2.495V; Voltage - Output (Max): 36V; Current - Output: 100mA; Tolerance: ±1%; Current - Cathode: 700µA; .Checked PCB: MM; Supplier 1: Digi-Key; Manufacturer Part Number: TL431AQDBZR; RoHS: RoHS Compliant; Category: Integrated Circuits (ICs); Stock 1: 14090; Pricing 1: 1=0.48, 10=0.323, 100=0.151, 1000=0.131 (USD); Packaging: Cut Tape (CT); Reference Type: Shunt; Temperature Coefficient: -; Noise - 0.1Hz to 10Hz: -; Noise - 10Hz to 10kHz: -; Voltage - Input: -; Current - Supply: -; Operating Temperature: -40°C ~ 125°C (TA); Mounting Type: Surface Mount; Package / Case: TO-236-3, SC-59, SOT-23-3; Supplier Device Package: SOT-23-3; ComponentLink1URL: http://www.ti.com/lit/ds/symlink/tl431a.pdf; ComponentLink1Description: http://www.ti.com/lit/ds/symlink/tl431a.pdf; Supplier Part Number 1: 296-18864-1-ND; .Checked SCH: MM; .Creator: MM